# EAGLE design Part_Ninja_V1b (EAGLE 5.07)
PROJECT: Part Ninja
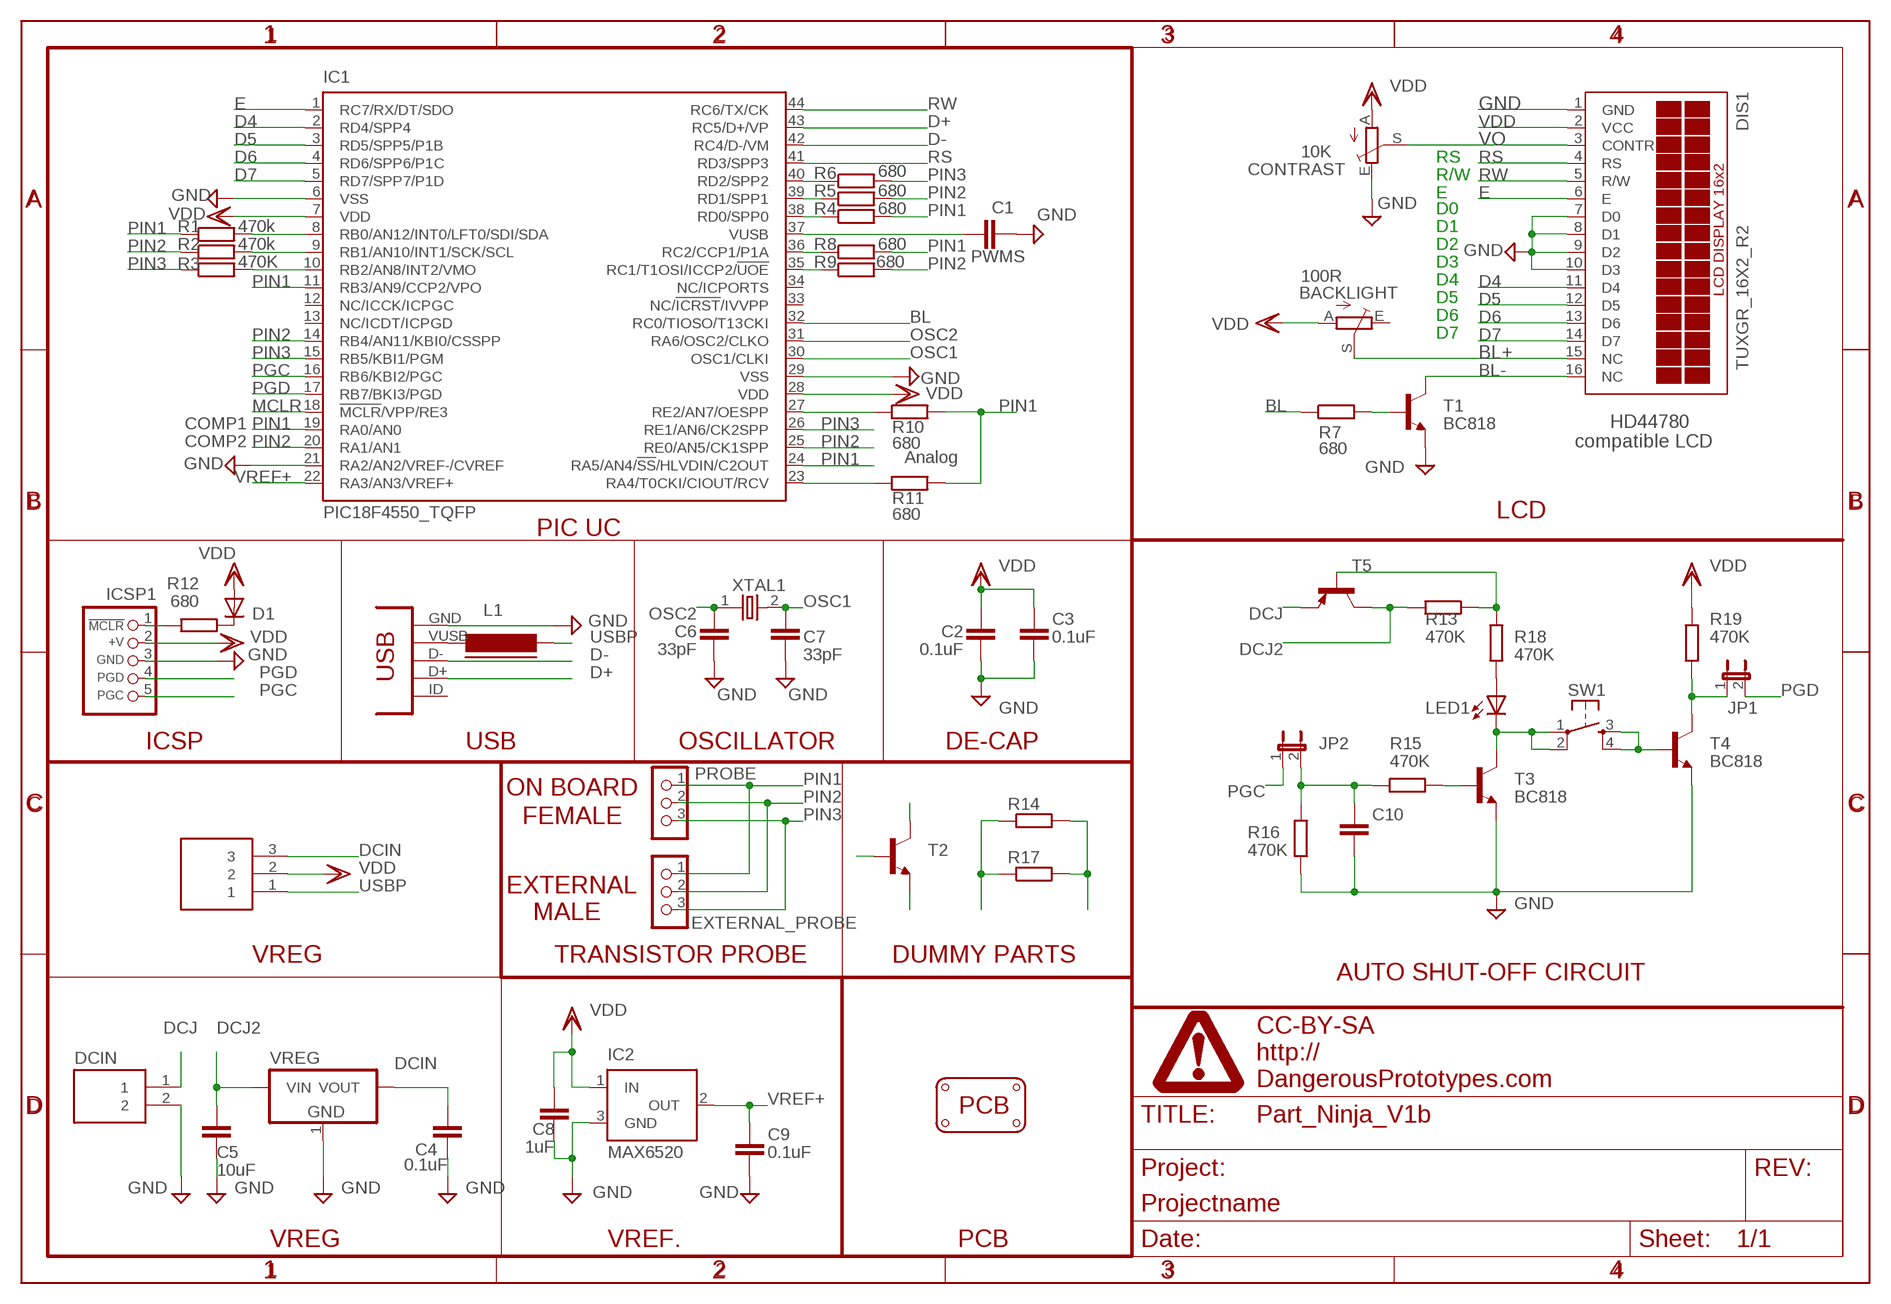
[diagram p0: schematic, sheet 1]

## Parts
BACKLIGHT  100R  TRIM_EU-B25P  [B25P]
C1  CAPC603  [C603]
C2  0.1uF  CAPC603  [C603]
C3  0.1uF  CAPC603  [C603]
C4  0.1uF  CAPC603  [C603]
C5  10uF  CAPC603  [C603]
C6  33pF  CAPC603  [C603]
C7  33pF  CAPC603  [C603]
C8  1uF  CAPC603  [C603]
C9  0.1uF  CAPC603  [C603]
C10  CAPC603  [C603]
CONTRAST  10K  TRIM_EU-B25P  [B25P]
D1  D-SOD123  [SOD123]
DCIN  HEADER1X2PTH  [M1X2]
DIS1  TUXGR_16X2_R2  [TUXGR_16X2_R2]
EXTERNAL_PROBE  CON_HEADER_1X03-2  [M1X3_2]
IC1  PIC18F4550_TQFP  [TQFP44]
IC2  MAX6520  [SOT23]
ICSP1  HEADER_PRG_PIC_ICSPB  [HEADER_PRG_1X05_ICSP_B]
JP1  JP1E  [JP1]
JP2  JP1E  [JP1]
L1  FERRITE_BEAD603  [FB603]
LED1  LED805  [LED-805]
PCB2  PCB_DP_RECTANGLE-6.2X10  [DP10062_V1]
PROBE  CON_HEADER_1X03-2  [M1X3_2]
PWR  HEADER1X3PTH  [M1X3]
R1  470k  RESISTORR603  [R603]
R2  470k  RESISTORR603  [R603]
R3  470K  RESISTORR603  [R603]
R4  680  RESISTORR603  [R603]
R5  680  RESISTORR603  [R603]
R6  680  RESISTORR603  [R603]
R7  680  RESISTORR603  [R603]
R8  680  RESISTORR603  [R603]
R9  680  RESISTORR603  [R603]
R10  680  RESISTORR603  [R603]
R11  680  RESISTORR603  [R603]
R12  680  RESISTORR603  [R603]
R13  470K  RESISTORR603  [R603]
R14  RESISTORR1206  [R1206]
R15  470K  RESISTORR603  [R603]
R16  470K  RESISTORR603  [R603]
R17  RESISTORR603  [R603]
R18  470K  RESISTORR603  [R603]
R19  470K  RESISTORR603  [R603]
SW1  SW-SMD-SMALL  [TACT_SWITCH_SMALL]
T1  BC818  NPNSOT23BEC  [SOT23-BEC]
T2  BC818  NPNSOT23BEC  [SOT23-BEC]
T3  BC818  NPNSOT23BEC  [SOT23-BEC]
T4  BC818  NPNSOT23BEC  [SOT23-BEC]
T5  BJT-PNPSOT23BEC  [SOT23-BEC]
U$1  DINA4_L  [DP_LOGO]
USB1  CON-USB-MINI-BUSB1  [CONN_USB_MINI-B]
VREG  LD1117-3.3SOT223  [SOT223]
XTAL1  OSC-XTAL  [HC-49U]

## Nets
BL: IC1.32(RC0/TIOSO/T13CKI) R7.1
BL+: BACKLIGHT.S DIS1.15(NC)
BL-: DIS1.16(NC) T1.C
D4: DIS1.11(D4) IC1.2(RD4/SPP4)
D5: DIS1.12(D5) IC1.3(RD5/SPP5/P1B)
D6: DIS1.13(D6) IC1.4(RD6/SPP6/P1C)
D7: DIS1.14(D7) IC1.5(RD7/SPP7/P1D)
D+: IC1.43(RC5/D+/VP) USB1.D+
D-: IC1.42(RC4/D-/VM) USB1.D-
DCIN: C4.2 PWR.3 VREG.2(VOUT)
DCJ: DCIN.1 T5.E
DCJ2: C5.2 R13.2 T5.C VREG.3(VIN)
E: DIS1.6(E) IC1.1(RC7/RX/DT/SDO)
GND: C1.2 C2.1 C3.1 C4.1 C5.1 C6.1 C7.1 C8.1 C9.1 C10.1 CONTRAST.E DCIN.2 DIS1.1(GND) DIS1.7(D0) DIS1.8(D1) DIS1.9(D2) DIS1.10(D3) IC1.6(VSS) IC1.21(RA2/AN2/VREF-/CVREF) IC1.29(VSS) IC2.3(GND) ICSP1.3(GND) R16.1 T1.E T3.E T4.E USB1.GND VREG.1(GND)
MCLR: IC1.18(!MCLR!/VPP/RE3) ICSP1.1(/MCLR) R12.1
N$1: R7.2 T1.B
N$2: IC1.8(RB0/AN12/INT0/LFT0/SDI/SDA) R1.2
N$3: IC1.9(RB1/AN10/INT1/SCK/SCL) R2.2
N$4: IC1.10(RB2/AN8/INT2/VMO) R3.2
N$5: IC1.38(RD0/SPP0) R4.1
N$6: IC1.39(RD1/SPP1) R5.1
N$7: IC1.40(RD2/SPP2) R6.1
N$8: IC1.27(RE2/AN7/OESPP) R10.1
N$9: LED1.A R18.1
N$10: C1.1 IC1.37(VUSB)
N$11: IC1.23(RA4/T0CKI/CIOUT/RCV) R11.1
N$12: IC1.36(RC2/CCP1/P1A) R8.1
N$13: IC1.35(RC1/T1OSI/ICCP2/!UOE) R9.1
N$14: D1.1(C) R12.2
N$16: SW1.3 SW1.4 T4.B
N$17: R13.1 R18.2 T5.B
N$18: LED1.C SW1.1 SW1.2 T3.C
N$19: R15.2 T3.B
N$21: JP1.1 R19.1 T4.C
N$22: C10.2 JP2.2 R15.1 R16.2
N$23: L1.1 USB1.VUSB
OSC1: C7.2 IC1.30(OSC1/CLKI) XTAL1.2
OSC2: C6.2 IC1.31(RA6/OSC2/CLKO) XTAL1.1
PGC: IC1.16(RB6/KBI2/PGC) ICSP1.5(PGC) JP2.1
PGD: IC1.17(RB7/BKI3/PGD) ICSP1.4(PGD) JP1.2
PIN1: EXTERNAL_PROBE.1 IC1.11(RB3/AN9/CCP2/VPO) IC1.19(RA0/AN0) IC1.24(RA5/AN4/!SS!/HLVDIN/C2OUT) PROBE.1 R1.1 R4.2 R8.2 R10.2 R11.2 R14.1 R17.1 T2.C
PIN2: EXTERNAL_PROBE.2 IC1.14(RB4/AN11/KBI0/CSSPP) IC1.20(RA1/AN1) IC1.25(RE0/AN5/CK1SPP) PROBE.2 R2.1 R5.2 R9.2 R14.2 R17.2 T2.B
PIN3: EXTERNAL_PROBE.3 IC1.15(RB5/KBI1/PGM) IC1.26(RE1/AN6/CK2SPP) PROBE.3 R3.1 R6.2 T2.E
RS: DIS1.4(RS) IC1.41(RD3/SPP3)
RW: DIS1.5(R/W) IC1.44(RC6/TX/CK)
USBP: L1.2 PWR.1
VDD: BACKLIGHT.A C2.2 C3.2 C8.2 CONTRAST.A D1.2(A) DIS1.2(VCC) IC1.7(VDD) IC1.28(VDD) IC2.1(IN) ICSP1.2(+V) PWR.2 R19.2
VO: CONTRAST.S DIS1.3(CONTR)
VREF+: C9.2 IC1.22(RA3/AN3/VREF+) IC2.2(OUT)
Unconnected: BACKLIGHT.E IC1.12(NC/ICCK/ICPGC) IC1.13(NC/ICDT/ICPGD) IC1.33(NC/!ICRST!/IVVPP) IC1.34(NC/ICPORTS) USB1.BODY@1(BODY) USB1.BODY@2(BODY) USB1.BODY@3(BODY) USB1.BODY@4(BODY) USB1.ID(USBID)

## Notes on the sheet
- RS
- R/W
- E
- D0
- D1
- PWMS | D2
- D3
- D4
- D5
- D6
- D7
- COMP1 | HD44780
- COMP2 | compatible LCD
- Analog
- LCD
- PIC UC
- ICSP | USB | OSCILLATOR | DE-CAP
- ON BOARD
- FEMALE
- EXTERNAL
- MALE
- VREG | TRANSISTOR PROBE | DUMMY PARTS
- AUTO SHUT-OFF CIRCUIT
- VREG | VREF. | PCB

## Library data of the parts
BACKLIGHT CONTRAST = pot:TRIM_EU-: POTENTIOMETER
C1-C10 = dp_devices:CAP
D1 = semicon-smd-ipc:D-: DIODE unfilled
DCIN = dp_devices:HEADER1X2
DIS1 = display-lcd:TUXGR_16X2_R2: Tuxgraphics LCD display 16x2 characters reflective, without background light Source: tuxgr_12x2_r2.pdf
EXTERNAL_PROBE PROBE = centered_logo:CON_HEADER_1X03
IC1 = microchip:PIC18F4*_TQFP: USB Microcontrollers with nanoWatt Technology High-Performance, Enhanced Flash, 28/40/44-Pin, Source: http://ww1.microchip.com/downloads/en/devicedoc/39632c.pdf; MF: MICROCHIP; MPN: PIC18F4550-I/PT; OC_FARNELL: 9321365; OC_NEWARK: 08J9633
IC2 = maxim:MAX6520: 1.2V Voltage Reference 50ppm/°C, SOT23, 3-Terminal Source: http://datasheets.maxim-ic.com/en/ds/MAX6520.pdf; MF: MAXIM; MPN: MAX6520EUR-T; OC_FARNELL: unknown; OC_NEWARK: 02J4586
ICSP1 = dp_devices:HEADER_PRG_PIC_ICSP: 5-pin PIC In Circuit Serial Programming header
JP1 JP2 = jumper:JP1E: JUMPER
L1 = dp_devices:FERRITE_BEAD
LED1 = DP2:LED
PCB2 = dp_devices:PCB_DP_RECTANGLE: Dangerous Prototypes Standard Rectangular PCB sizes
PWR = dp_devices:HEADER1X3
R1-R13 R15 R16 R18 R19 = dp_devices:RESISTOR
R14 R17 = fifo:RESISTOR
SW1 = dp_devices:SW-SMD-SMALL
T1-T4 = dp_devices:NPN: Most commonly used is SOT23-BEC
T5 = DP2:BJT-PNP: Most commonly used is SOT23-BEC
U$1 = DP2:DINA4_L: A4 DP frame Standard Dangerous Prototypes schematic frame. Automagically adds the DP logo and standard texts to the PCB Use the atrribute in the schematic editor to change the fields.; FF1: fulfillment by; FF2: Seeed Studio; FF3: www.seeedstudio.com; LICENSE: CC-BY-SA; PROJECT: Projectname; URL1: http://; URL2: DangerousPrototypes.com
USB1 = dp_devices:CON-USB-MINI-B: USB connector
VREG = dp_devices:LD1117-3.3
XTAL1 = dp_devices:OSC-XTAL

## Board
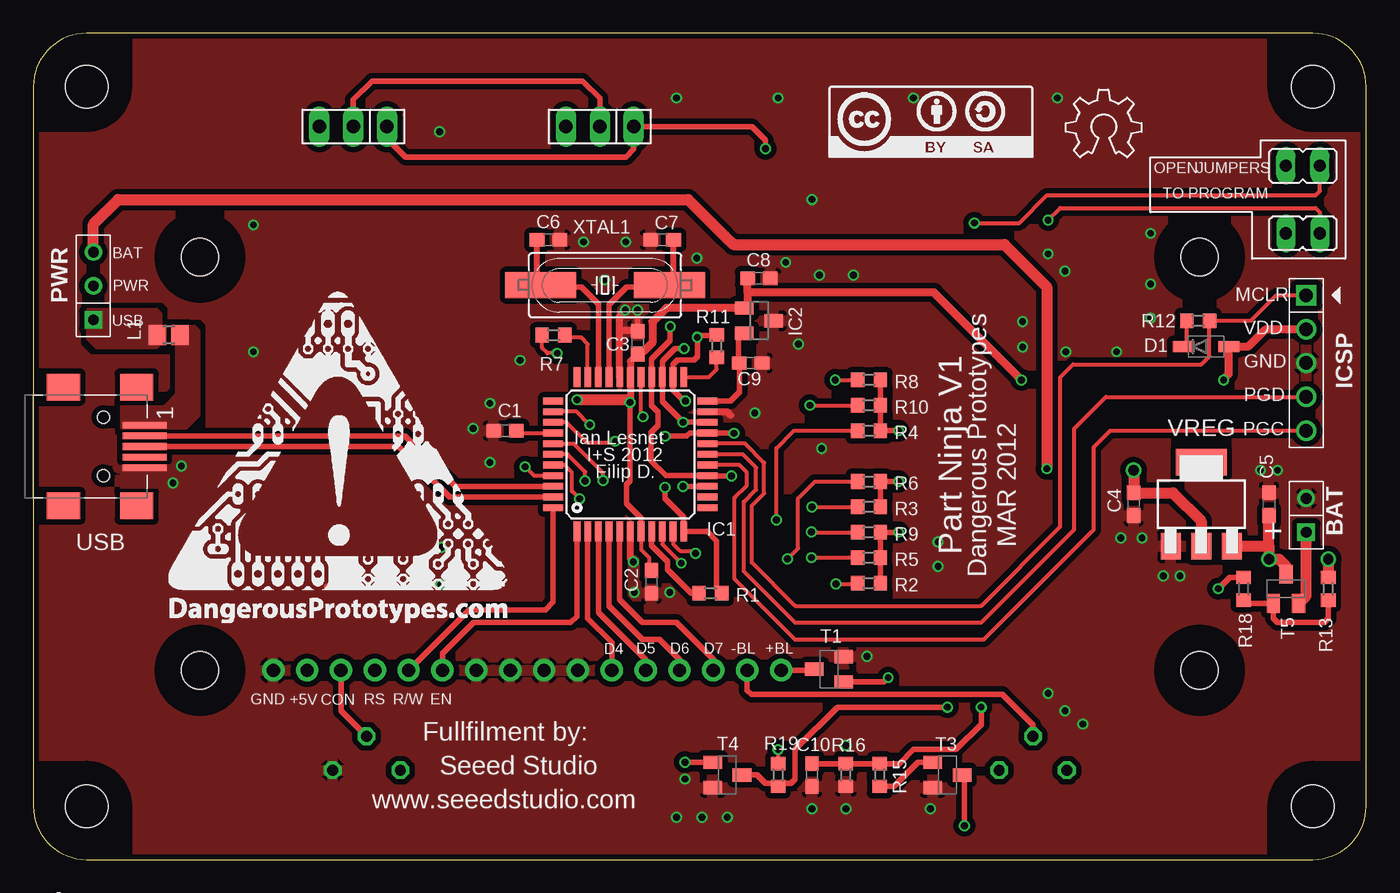
[diagram p1: board, top side]
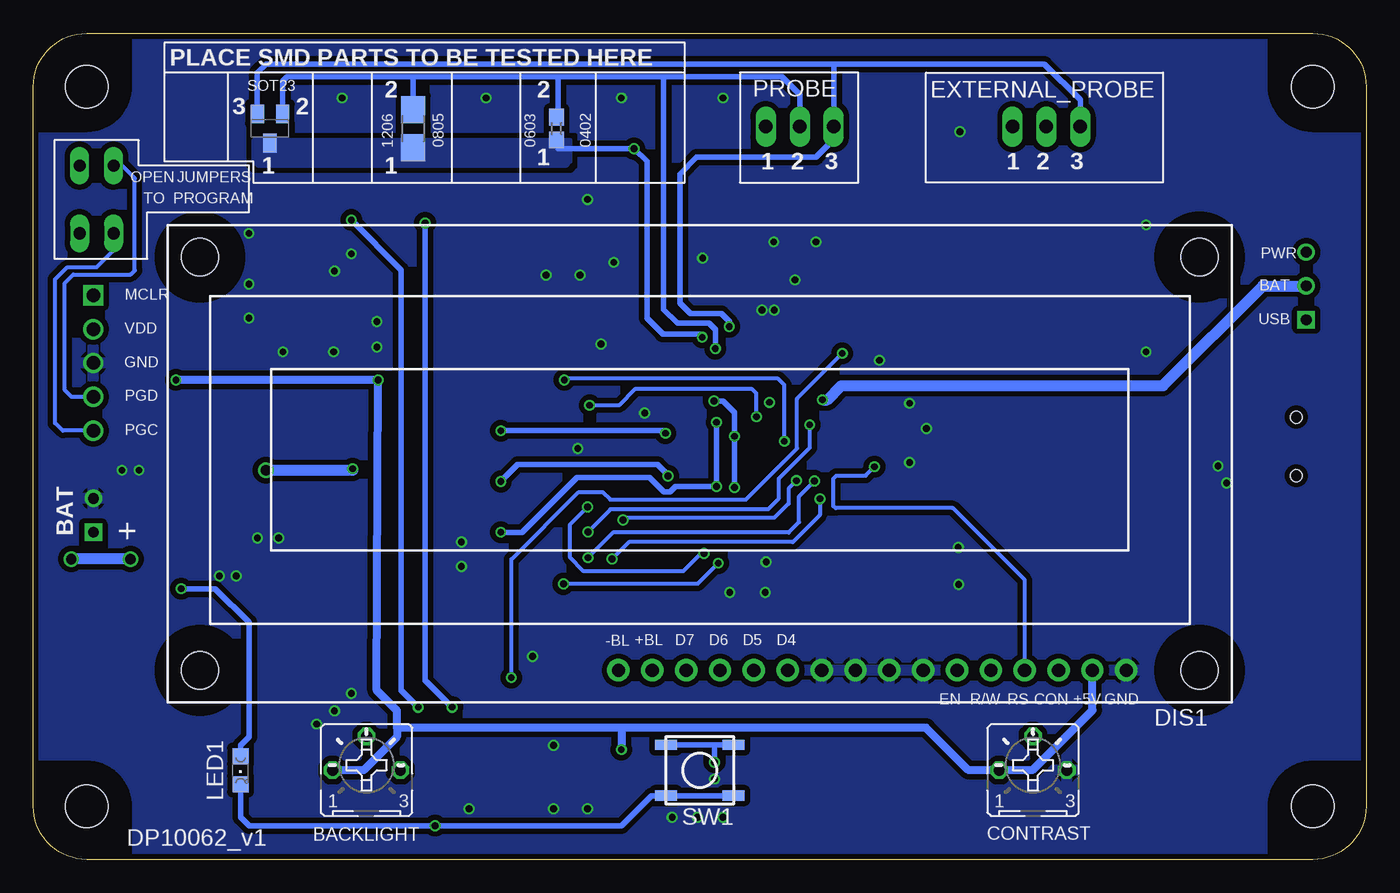
[diagram p2: board, bottom side, seen from below]

Size 100 x 62 mm. Coordinates in mm from the lower left corner, seen from the top.
Copper layers (1*16): Top 0.035mm / dielectric 1.5mm / Bottom 0.035mm
Design rules "Fusion_eagle_rule_v1.1": minimum track width 6mil, minimum drill 12mil, track to track 6mil, track to pad 6mil, pad to pad 6mil, via to via 6mil, smd to smd 0mil, copper to edge 10mil, drill to drill 10mil, minimum pad ring 10mil, minimum via ring 6mil, stop-mask expansion 2mil, vias tented up to drill 100mil, thermal gap 10mil
tRestrict: area 9.5,42.2 to 15.5,48.2; area 9.5,11.2 to 15.5,17.2; area 84.5,42.2 to 90.5,48.2; area 84.5,11.2 to 90.5,17.2
bRestrict: area 9.5,42.2 to 15.5,48.2; area 9.5,11.2 to 15.5,17.2; area 84.5,42.2 to 90.5,48.2; area 84.5,11.2 to 90.5,17.2

### Footprints (pad centres in the part's own frame; a part is rotated, then mirrored left to right if it is on the bottom)
B25P = drill 0.813 octagon: A -2.54,0; E 2.54,0; S 0,2.54
C603 = smd 1.1 x 1: 1 -0.85,0; 2 0.85,0
SOD123 = smd 1.6 x 0.8: 1 -1.7,0; 2 1.7,0
M1X2 = drill 0.8 square: 1 -1.27,0 | drill 0.8 round: 2 1.27,0
TUXGR_16X2_R2 = drill 1 pad 1.676 round: 1 -32,15.5; 2 -29.46,15.5; 3 -26.92,15.5; 4 -24.38,15.5; 5 -21.84,15.5; 6 -19.3,15.5; 7 -16.76,15.5; 8 -14.22,15.5; 9 -11.68,15.5; 10 -9.14,15.5; 11 -6.6,15.5; 12 -4.06,15.5; 13 -1.52,15.5; 14 1.02,15.5; 15 3.56,15.5; 16 6.1,15.5 | hole 2.8: -37.5,-15.5; 37.5,-15.5; -37.5,15.5; 37.5,15.5
M1X3_2 = drill 1.016 long: 1 -2.54,0; 2 0,0; 3 2.54,0
TQFP44 = smd 1.5 x 0.5: 1 -5.8,4; 2 -5.8,3.2; 3 -5.8,2.4; 4 -5.8,1.6; 5 -5.8,0.8; 6 -5.8,0; 7 -5.8,-0.8; 8 -5.8,-1.6; 9 -5.8,-2.4; 10 -5.8,-3.2; 11 -5.8,-4; 23 5.8,-4; 24 5.8,-3.2; 25 5.8,-2.4; 26 5.8,-1.6; 27 5.8,-0.8; 28 5.8,0; 29 5.8,0.8; 30 5.8,1.6; 31 5.8,2.4; 32 5.8,3.2; 33 5.8,4 | smd 0.5 x 1.5: 12 -4,-5.8; 13 -3.2,-5.8; 14 -2.4,-5.8; 15 -1.6,-5.8; 16 -0.8,-5.8; 17 0,-5.8; 18 0.8,-5.8; 19 1.6,-5.8; 20 2.4,-5.8; 21 3.2,-5.8; 22 4,-5.8; 34 4,5.8; 35 3.2,5.8; 36 2.4,5.8; 37 1.6,5.8; 38 0.8,5.8; 39 0,5.8; 40 -0.8,5.8; 41 -1.6,5.8; 42 -2.4,5.8; 43 -3.2,5.8; 44 -4,5.8
SOT23 = smd 1 x 1.4: 1 -0.95,-1.1; 2 0.95,-1.1; 3 0,1.1
HEADER_PRG_1X05_ICSP_B = drill 1.016 square: 1 -5.08,0 | drill 1.016 round: 2 -2.54,0; 3 0,0; 4 2.54,0; 5 5.08,0
JP1 = drill 0.914 long: 1 0,-1.27; 2 0,1.27
FB603 = smd 1.3 x 1.5: 1 -0.85,0; 2 0.85,0
LED-805 = smd 1.2 x 1.2: A 0,-1.05; C 0,1.05
DP10062_V1 = hole 3.2: 4,4; 96,4; 96,58; 4,58
M1X3 = drill 0.8 square: 1 0,0 | drill 0.8 round: 2 2.54,0; 3 5.08,0
R603 = smd 1 x 1.1: 1 -0.85,0; 2 0.85,0
R1206 = smd 2.032 x 1.803: 1 -1.422,0; 2 1.422,0
R603' = smd 1.27 x 1.1: 1 -0.85,0; 2 0.85,0
TACT_SWITCH_SMALL = smd 1.651 x 0.762: 1 -2.54,1.905; 2 2.54,1.905; 3 -2.54,-1.905; 4 2.54,-1.905
SOT23-BEC@1 = smd 1 x 1.4: B -0.95,-1.1; C 0,1.1; E 0.95,-1.1
SOT23-BEC = smd 1 x 1.4: B -0.95,-1.1; C 0,1.1; E 0.95,-1.1
CONN_USB_MINI-B = smd 2 x 2.5: BODY@1 -4.45,2.5; BODY@2 4.45,2.5; BODY@3 4.45,-3; BODY@4 -4.45,-3 | smd 0.5 x 3.3: D+ 0,3.1; D- -0.8,3.1; GND 1.6,3.1; ID 0.8,3.1; VUSB -1.6,3.1 | hole 0.9: -2.2,0; 2.2,0
SOT223 = smd 1.5 x 2: 1 -2.3,-3.15; 2 0,-3.15; 3 2.3,-3.15 | smd 3.8 x 2: 4 0,3.15
HC-49U = smd 5.334 x 1.93: 1 -4.826,0; 2 4.826,0

### Placement (x,y rotation side)
BACKLIGHT  75,6.7 0 bottom
C1  35.4,32.18 180 top
C2  46.39,20.84 90 top
C3  45.34,38.78 270 top
C4  82.55,26.67 90 top
C5  92.71,26.67 270 top
C6  38.64,46.5 180 top
C7  47.18,46.5 0 top
C8  54.45,43.61 180 top
C9  53.81,37.26 180 top
C10  58.42,6.35 90 top
CONTRAST  25,6.7 0 bottom
D1  87.99,38.5 0 top
DCIN  95.5,25.83 90 top
DIS1  50,29.7 180 bottom
EXTERNAL_PROBE  24,55 180 top
IC1  44.8,30.4 90 top
IC2  54.45,40.43 270 top
ICSP1  95.5,37.26 270 top
JP1  95.25,52.07 90 top
JP2  95.25,46.99 270 top
L1  10.16,39.37 180 top
LED1  84.45,6.7 180 bottom
PCB2  0,0 0 top
PROBE  42.5,55 180 top
PWR  4.5,40.5 90 top
R1  50.8,19.99 180 top
R2  62.7,20.75 180 top
R3  62.7,26.46 180 top
R4  62.7,32.18 0 top
R5  62.7,22.65 0 top
R6  62.7,28.37 0 top
R7  39.02,39.35 180 top
R8  62.7,35.99 0 top
R9  62.7,24.56 0 top
R10  62.7,34.08 0 top
R11  51.27,38.53 90 top
R12  87.39,40.43 180 top
R13  97.16,20.32 90 top
R14  71.5,54.85 90 bottom
R15  63.5,6.35 270 top
R16  60.96,6.35 90 top
R17  [R603']  60.75,54.85 90 bottom
R18  90.81,20.32 270 top
R19  55.88,6.35 90 top
SW1  50,6.7 180 bottom
T1  BC818  [SOT23-BEC@1]  59.69,14.29 90 top
T2  82.25,54.85 180 bottom
T3  68.58,6.35 270 top
T4  52.07,6.35 270 top
T5  93.98,20.32 0 top
U$1  1.91,-5.08 0 top  (outside the outline)
U$2  [DP_LOGO_ART_1X1]  10.16,17.78 0 top
U$4  [CC-BY-SA]  59.69,52.7 0 top
U$6  [OSHW_6X200_NOTEXT]  77.47,52.7 0 top
USB1  5.25,31 270 top
VREG  87.63,26.67 0 top
XTAL1  42.89,43.1 0 top

### Tracks (layer width: path | path; a pad name or v marks a point on that pad's centre or on a via)
BL
  Top 0.305: IC1.32 41.6,38.68 41.12,39.16 40.06,39.16 R7.1
BL+
  Top 0.406: BACKLIGHT.S 75,10.09 72.71,12.38 53.88,12.38 53.56,12.7 DIS1.15
BL-
  Top 0.406: DIS1.16 58.36,14.2 T1.C
D4
  Top 0.406: IC1.2 41.6,18.09 43.4,16.29 DIS1.11
D5
  Top 0.406: IC1.3 42.4,18.56 45.94,15.02 DIS1.12
D6
  Top 0.406: IC1.4 43.2,19.03 45.72,16.51 46.99,16.51 48.48,15.02 DIS1.13
D7
  Top 0.406: IC1.5 44,19.5 45.72,17.78 48.26,17.78 51.02,15.02 DIS1.14
D+
  Top 0.406: USB1.D+ 27.42,31 31.22,27.2 IC1.43
D-
  Top 0.406: USB1.D- 27.89,31.8 31.69,28 IC1.42
DCIN  (via drill 0.51, 0.76)
  Top 0.813: v76.04,29.32 76.04,42.97 72.86,46.15 52.51,46.15 51.87,46.79 50.92,47.74 49.13,49.53 6.35,49.53 4.5,47.68 PWR.3 | VREG.2 87.63,25.4 85.51,27.52 C4.2 v82.55,29.21
  Bottom 0.813: v82.55,29.21 76.04,29.21 v76.04,29.32
DCJ
  Top 0.813: DCIN.1 95.5,19.79 T5.E
DCJ2  (via drill 0.76)
  Top 0.813: R13.2 97.05,21.17 97.16,21.27 v97.16,22.54 | 92.71,23.5 v92.71,22.54 93.46,22.54 94,22 94,21.44 T5.C | 92.71,23.5 C5.2 | VREG.3 92.69,23.52 92.71,23.5
  Bottom 0.813: v92.71,22.54 v97.16,22.54
E
  Top 0.406: IC1.1 40.8,18.25 40.32,17.78 33.02,17.78 30.7,15.46 DIS1.6
GND  (via drill 0.51)
  Top 0.406: v45.34,41.23 45.34,40.59 45.34,39.7 C3.1
  Top 0.457: 22.1,20.49 22.1,20.46 22.03,20.46 22.01,20.48
  Top 0.508: IC1.6 44.8,22.56 v45.02,22.34 | IC1.29 44,40.81 v44.42,41.23 | IC1.21 52.08,33.6 52.32,33.35 | 45.34,39.7 44,39.7 44,39.73
  other vias: 67.88,21.99 47.75,20.05 45.08,20.05 11.11,29.53 54.13,33.51 42.86,43.5 41.27,46.35 44.45,46.35 34.26,34.24 32.99,32.34 34.26,29.8 58.99,43.86 59.15,30.84 57.4,38.69 61.53,43.86 93.34,29.21 92.08,29.21 62.55,15.24 67.31,3.81 60.96,3.81 48.26,3.17 76.14,45.45 74.23,40.37 74.23,38.47 76.14,12.46 77.41,11.16 86.04,21.27 83.19,24.13 67.88,23.83 78.74,10.16 83.82,43.18 83.82,46.99 81.28,38.1 83.82,40.64 77.41,44.15 77.47,38.1 52.07,3.17 50.16,3.17 48.9,6.03 60.96,8.57 58.42,3.81 36.51,37.47 16.51,38.1 16.51,47.62 58.42,49.53 30.61,23.42 30.57,20.65 81.6,24.13 84.77,21.27 10.48,28.26 48.26,57.15 55.88,57.15 66.04,57.15 76.83,57.15 30.48,54.61 56.45,44.82 49.78,45.13
  pour Top (isolate 0.406, rank 6): 0,0 0,62 100,62 100,0
  pour Bottom (isolate 0.406, rank 6): 0,0 0,62 100,62 100,0
  pour Top (no thermals): 7.3,29.53 10.79,29.53 11.11,29.21 11.11,28.57 10.48,27.94 6.67,27.94 6.67,29.53
MCLR
  Top 0.305: IC1.18 53.4,31.2 54.83,29.77 54.83,27.48 53.91,26.56 53.91,22.29 57.15,19.05 71.12,19.05 77.06,24.99 77.06,36.2 78.01,37.15 87.63,37.15 88.24,37.76 R12.1 91.36,40.43 93.26,42.34 ICSP1.1
N$1  (via drill 0.51)
  Top 0.305: R7.2 38.17,38.39 38.58,37.99 v39.3,37.99
  Top 0.406: T1.B 63.82,13.34 v64.14,13.65
  Bottom 0.305: v39.3,37.99 42.7,34.59 42.7,30.84 46.54,27 56.7,27 57.28,27.57 59.09,27.57 64.14,22.52 v64.14,13.65
N$2
  Top 0.406: IC1.8 46.4,23.56 47.59,22.37 47.59,21.77 49.37,19.99 R1.2
N$3  (via drill 0.51)
  Top 0.305: v60.23,20.68 61.79,20.68 R2.2 | IC1.9 47.2,23.65 v48.61,22.24
  Bottom 0.305: v48.61,22.24 50.16,20.68 v60.23,20.68
N$4  (via drill 0.51)
  Top 0.305: v58.42,26.46 R3.2 | IC1.10 48,23.68 48.51,23.16 49.5,23.16 v49.69,22.97
  Top 0.406: R3.2
  Bottom 0.305: v58.42,26.46 59.72,25.16 59.72,22.65 58.7,21.64 51.24,21.64 49.91,22.97 v49.69,22.97
N$5  (via drill 0.51)
  Top 0.305: v55.75,25.48 55.75,30.84 57.09,32.18 R4.1 | IC1.38 40.54,31.2 42.7,29.04 42.7,28.46 v42.73,28.43
  Bottom 0.305: v55.75,25.48 55.47,25.64 44.42,25.64 43.34,26.72 43.34,27.83 v42.73,28.43
N$6  (via drill 0.51)
  Top 0.305: v58.39,22.65 R5.1 | v58.39,22.65 | IC1.39 40.1,30.4 41.4,29.1 v41.4,28.4
  Bottom 0.305: v58.39,22.65 56.51,24.53 43.34,24.53 42.54,25.32 42.54,27.26 v41.4,28.4
N$7  (via drill 0.51)
  Top 0.305: IC1.40 39.84,29.61 40.42,29.04 40.42,27.64 v40.99,27.07 | v56.58,22.56 57.37,23.35 57.37,27.1 58.64,28.37 R6.1
  Top 0.406: IC1.40
  Bottom 0.305: v56.58,22.56 55.31,23.83 43.02,23.83 40.99,25.86 v40.99,27.07
N$8  (via drill 0.51)
  Top 0.305: v58.26,34.08 R10.1 | IC1.27 45.6,33.2 v45.75,33.23
  Bottom 0.305: v58.26,34.08 56.07,34.08 54.86,35.29 46.07,35.29 45.75,34.97 v45.75,33.23
N$9  (via drill 0.51)
  Top 0.406: R18.1 89.75,21.17 v88.9,20.32
  Bottom 0.406: v88.9,20.32 86.36,20.32 83.82,17.78 83.82,9.21 84.45,8.57 LED1.A
N$10
  Top 0.305: 36.43,32 IC1.37
  Top 0.406: C1.1 36.43,32
N$11
  Top 0.305: IC1.23 50.69,36.2 51.27,36.78 R11.1
N$12  (via drill 0.51)
  Top 0.305: v60.16,35.99 R8.1 | 39.04,32.84 39.97,32.84 41.53,31.29 43.62,31.29 v43.66,31.39
  Top 0.406: IC1.36 39.04,32.84
  Bottom 0.305: 43.69,31.42 v43.66,31.39 43.66,35.61 44.13,36.08 60.07,36.08 v60.16,35.99
N$13  (via drill 0.51)
  Top 0.305: IC1.35 40.77,33.61 v41.75,32.62 | R9.1 58.42,24.56 v58.39,24.59
  Top 0.406: IC1.35
  Bottom 0.305: v41.75,32.62 41.75,30.91 44.07,28.59 44.07,27.1 44.89,26.27 56.7,26.27 v58.39,24.59
N$14
  Top 0.305: R12.2 86.54,38.74 D1.1
N$16  (via drill 0.51)
  Top 0.406: T4.B 50.48,7.3 v48.9,7.3
  Bottom 0.406: SW1.3 48.9,8.61 | 48.9,8.61 SW1.4 | 48.9,8.61 v48.9,7.3
N$17
  Top 0.406: R18.2 91.06,19.22 T5.B 93.03,18.09 93.34,17.78 96.84,17.78 97.16,18.1 R13.1
N$18  (via drill 0.51)
  Top 0.406: T3.C 69.85,6.35 v69.85,2.54
  Bottom 0.406: SW1.1 SW1.2 53.62,4.79 55.88,2.54 v69.85,2.54 83.82,2.54 84.45,3.17 LED1.C
N$19
  Top 0.406: R15.2 64.56,5.5 66.36,7.3 T3.B
N$21  (via drill 0.51)
  Top 0.305: v70.61,47.77 73.98,47.77 76.06,49.85 96.2,49.85 96.52,50.16 JP1.1
  Top 0.406: T4.C 54.29,6.35 54.93,5.71 55.66,5.71 R19.1 55.88,5.71 56.83,5.71 57.15,6.03 57.15,8.26 60.33,11.43 v68.58,11.43
  Bottom 0.406: v70.61,47.77 70.61,13.46 v68.58,11.43
N$22  (via drill 0.51)
  Top 0.305: JP2.2 96.52,48.58 96.2,48.9 77.04,48.9 v76.14,47.99
  Top 0.406: C10.2 R16.2 R15.1 64.98,7.2 66.04,8.26 69.22,8.26 71.12,10.16 v71.12,11.43
  Bottom 0.406: v71.12,11.43 72.39,12.7 72.39,44.24 v76.14,47.99
N$23
  pour Top (no thermals): 6.67,32.38 6.67,33.97 9.84,33.97 10.79,34.92 10.79,40.01 12.06,40.01 12.38,39.69 12.38,33.34 11.43,32.38
OSC1
  Top 0.406: IC1.30 43.2,41.66 44.51,42.97 47.59,42.97 XTAL1.2
  Top 0.457: C7.2 48.03,43.41 XTAL1.2
OSC2
  Top 0.406: IC1.31 42.4,41.69 41.12,42.97 38.19,42.97 XTAL1.1
  Top 0.457: C6.2 37.79,43.38 XTAL1.1
PGC
  Top 0.305: IC1.16 52.96,29.6 53.53,29.04 53.53,28.08 52.61,27.16 52.61,21.05 57.15,16.51 71.31,16.51 79.56,24.77 79.56,30.94 80.8,32.18 ICSP1.5
  Bottom 0.305: ICSP1.5 97.79,32.18 98.36,32.75 98.36,43.55 97.45,44.45 95.25,44.45 93.98,45.72 JP2.1
PGD
  Top 0.305: IC1.17 53.24,30.4 54.23,29.42 54.23,27.77 53.31,26.84 53.31,21.62 57.15,17.78 71.12,17.78 78.11,24.77 78.11,32.34 80.48,34.72 ICSP1.4
  Bottom 0.305: ICSP1.4 97.12,34.72 97.63,35.23 97.63,43.26 96.99,43.89 92.71,43.89 92.39,44.21 92.39,51.12 93.34,52.07 JP1.2
PIN1  (via drill 0.51)
  Top 0.305: 52.55,31.99 52.55,32.02 | v49.81,39.2 49.94,39.32 | R1.1 51.27,20.36
  Top 0.406: 63.55,32.39 R10.2 R8.2 | 63.55,32.39 R4.2 | 63.55,32.39 63.34,32.18 v64.93,32.18 | v52.58,31.99 52.55,31.99 50.61,31.99 IC1.19 50.58,32.02 49.27,32.02 49.02,31.77 v47.4,31.77 | v47.4,27.92 47.4,27.1 48.8,25.7 IC1.11 50.6,24.6 51.27,23.92 51.27,20.36 | 49.94,39.32 50.58,39.32 R11.2 | v49.81,39.2 49.81,37.73 49.56,37.48 48.32,37.48 48,37.16 IC1.24 48,35.23 48.83,34.4 v48.92,34.4 | v54.93,53.34 54.93,53.98 53.9,55 PROBE.1 45.04,53.3 44.45,52.7 27.94,52.7 26.54,54.1 EXTERNAL_PROBE.1
  Bottom 0.406: v64.93,32.18 52.77,32.18 v52.58,31.99 | v48.92,34.4 48.26,34.4 47.4,33.54 v47.4,31.77 v47.4,27.92 | v49.81,39.2 50.04,39.42 52.8,39.42 52.8,39.46 53.98,40.64 53.98,52.39 v54.93,53.34 60.64,53.34 60.64,53.89 R17.1
  pour Bottom (no thermals): 60.64,53.98 83.5,53.98 83.5,52.39 83.19,52.07 60.01,52.07 59.69,52.39 59.69,53.98
PIN2  (via drill 0.51)
  Top 0.406: IC1.20 50.59,32.81 v48.73,32.81 47.2,34.35 IC1.25 47.2,37.4 48.13,38.34 v48.83,38.34 | IC1.14 48.75,28 v48.73,27.99 | R2.1 R5.2 R9.2 v64.93,24.56 | PROBE.2 42.5,57.12 41.2,58.42 25.4,58.42 24,57.02 EXTERNAL_PROBE.2
  Bottom 0.406: v48.73,32.81 v48.73,27.99 51.81,27.99 52.23,27.57 52.67,27.57 53.78,28.69 59.21,28.69 63.34,24.56 v64.93,24.56 | v48.83,38.34 48.83,38.97 48.83,39.77 49.31,40.24 51.67,40.24 52.7,41.27 52.7,58.74 | 52.7,58.74 43.81,58.74 42.47,57.39 42.47,55.03 PROBE.2 | 52.7,58.74 60.64,58.74 | 60.64,55.88 60.64,55.81 R17.2 60.75,55.77 60.64,55.88 | 60.64,58.74 60.64,55.88 | T2.B 81.3,58.4 80.96,58.74 71.44,58.74 | 60.64,58.74 71.44,58.74 | R14.2 71.5,58.67 71.44,58.74
PIN3  (via drill 0.51)
  Top 0.406: R3.1 R6.2 v64.93,28.37 | v52.39,28.78 50.62,28.78 IC1.15 47.47,28.8 46.35,29.91 46.35,32.05 46.86,32.56 46.86,33.58 46.38,34.05 46.38,36.19 IC1.26 | IC1.26 46.42,36.18 | IC1.26 46.4,37.56 47.78,38.94 v47.78,39.99 | v47.78,39.99
  Bottom 0.305: v52.39,28.78 52.39,28.84
  Bottom 0.406: v47.78,39.99 47.78,40.37 48.39,40.97 50.7,40.97 51.5,41.77 51.5,51.44 50.23,52.7 41.27,52.7 39.93,54.05 39.96,54.08 PROBE.3 39.93,55.03 39.93,59.69 | 52.39,28.84 53.18,29.64 63.66,29.64 v64.93,28.37 | T2.E 83.2,59.04 82.55,59.69 39.93,59.69 | 39.93,59.69 24.13,59.69 21.46,57.02 EXTERNAL_PROBE.3
RS  (via drill 0.51)
  Top 0.305: IC1.41 37.57,28.8 v36.89,29.48
  Bottom 0.305: v36.89,29.48 | v36.89,29.48 37.56,28.81 39.75,28.81 39.97,28.59 39.97,26.53 39.81,26.37 31.02,26.37 25.62,20.97 DIS1.4
RW
  Top 0.406: DIS1.5 32.7,18.73 38.42,18.73 39,19.31 IC1.44
USBP
  pour Top (no thermals): 4.13,41.27 9.21,41.27 9.53,40.96 9.53,38.73 9.21,38.42 4.76,38.42 4.13,39.05
VDD  (via drill 0.51)
  Top 0.305: IC1.7 45.6,23.25 46.2,22.65 46.2,21.88 C2.2 | v55.88,8.26 R19.2
  Top 0.406: IC1.7 45.6,25.63 44.51,26.72 44.51,28.15 44.77,28.4 v44.77,34.31
  Top 0.508: C3.2 44.8,37.39 IC1.28 44.8,34.34 v44.77,34.31
  Top 0.61: ICSP1.2 92.47,39.8 91.17,38.5 D1.2 89.69,36.42 v89.3,35.99 | IC2.1 47.49,41.38 46.45,40.34 46.45,38.78 45.81,38.15 45.55,38.15 C3.2 | IC2.1 53.35,41.28 53.34,41.27 | IC2.1 53.6,41.63 53.6,42.55 | 53.6,42.55 C8.2 | 53.6,42.55 67.58,42.55 v74.14,35.99
  Top 0.813: v40.8,34.5 44.58,34.5 v44.77,34.31
  Bottom 0.61: v89.3,35.99 v74.14,35.99 74.22,12.68 72.71,11.16 72.71,9.89 | DIS1.2 20.54,11.21 25.05,6.7 CONTRAST.A 29.83,6.7 33.02,9.89 55.88,9.89 | 55.88,9.89 72.71,9.89 | 55.88,9.89 v55.88,8.26 | BACKLIGHT.A 75.22,6.7 72.71,9.21 72.71,9.89
  Bottom 0.813: v40.8,34.5 40.43,34.5 39.37,35.56 15.24,35.56 7.76,43.04 PWR.2
VO
  Top 0.406: DIS1.3 23.08,11.16 CONTRAST.S
VREF+
  Top 0.406: IC2.2 53.15,39.48 52.89,39.23 52.89,37.39 C9.2 52.97,35.08 52.29,34.4 IC1.22 | IC1.22

### Text on the board
tPlace: Dangerous Prototypes | Part Ninja V1 | MAR 2012 | Ian Lesnet | I+S 2012 | Filip D. | Fullfilment by: | Seeed Studio | www.seeedstudio.com
tNames: OPEN | JUMPERS | TO | PROGRAM | BAT | PWR | MCLR | USB | ICSP | VDD | GND | PGD | PGC | + | BAT | USB | D4 | D5 | D6 | D7 | -BL | +BL | GND | +5V | CON | RS | R/W | EN
bNames: PLACE SMD PARTS TO BE TESTED HERE | SOT23 | 2 | 2 | 2 | 3 | 0402 | 0603 | 0805 | 1206 | 3 | 2 | 1 | 3 | 2 | 1 | 1 | 1 | 1 | JUMPERS | OPEN | PROGRAM | TO | PWR | BAT | MCLR | USB | VDD | GND | PGD | PGC | + | BAT | D4 | D5 | D6 | D7 | +BL | -BL | GND | +5V | CON | RS | R/W | EN